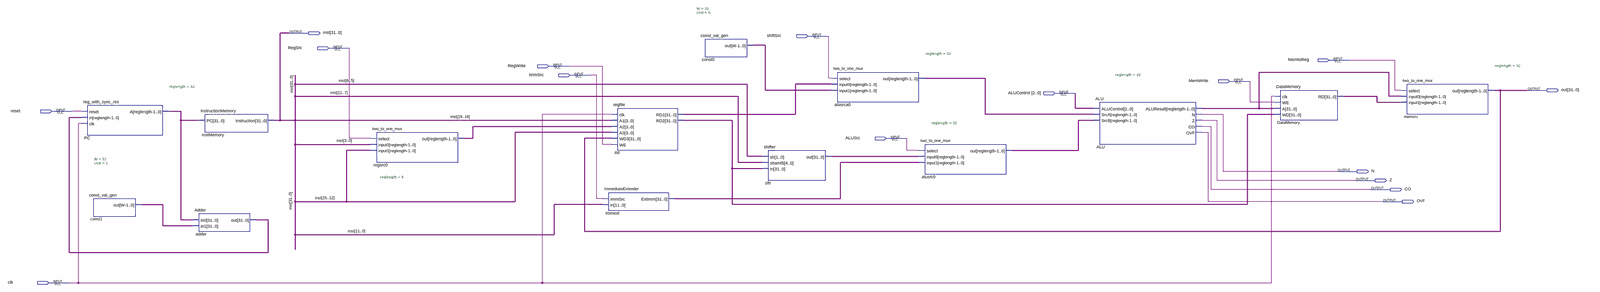
[diagram p0: schematic sheet, whole]
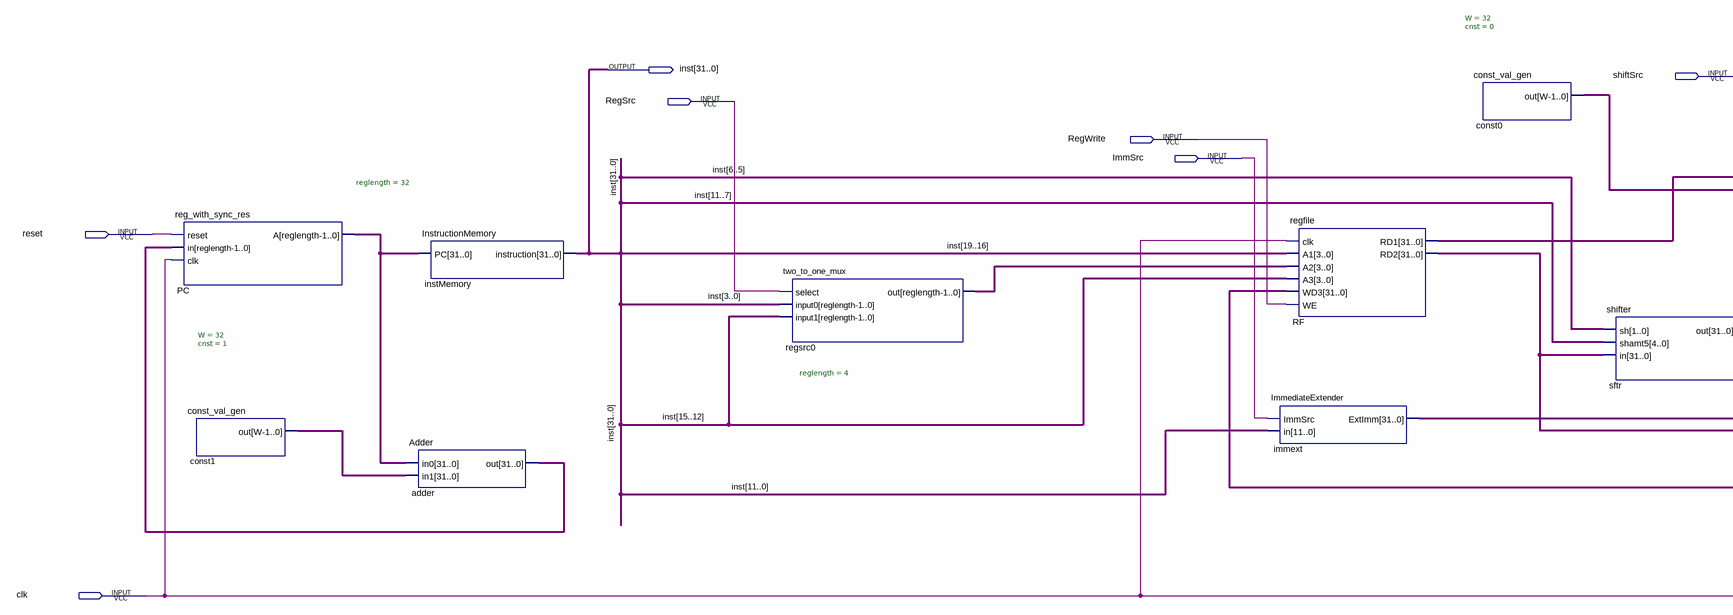
[diagram p1: schematic sheet, left part]
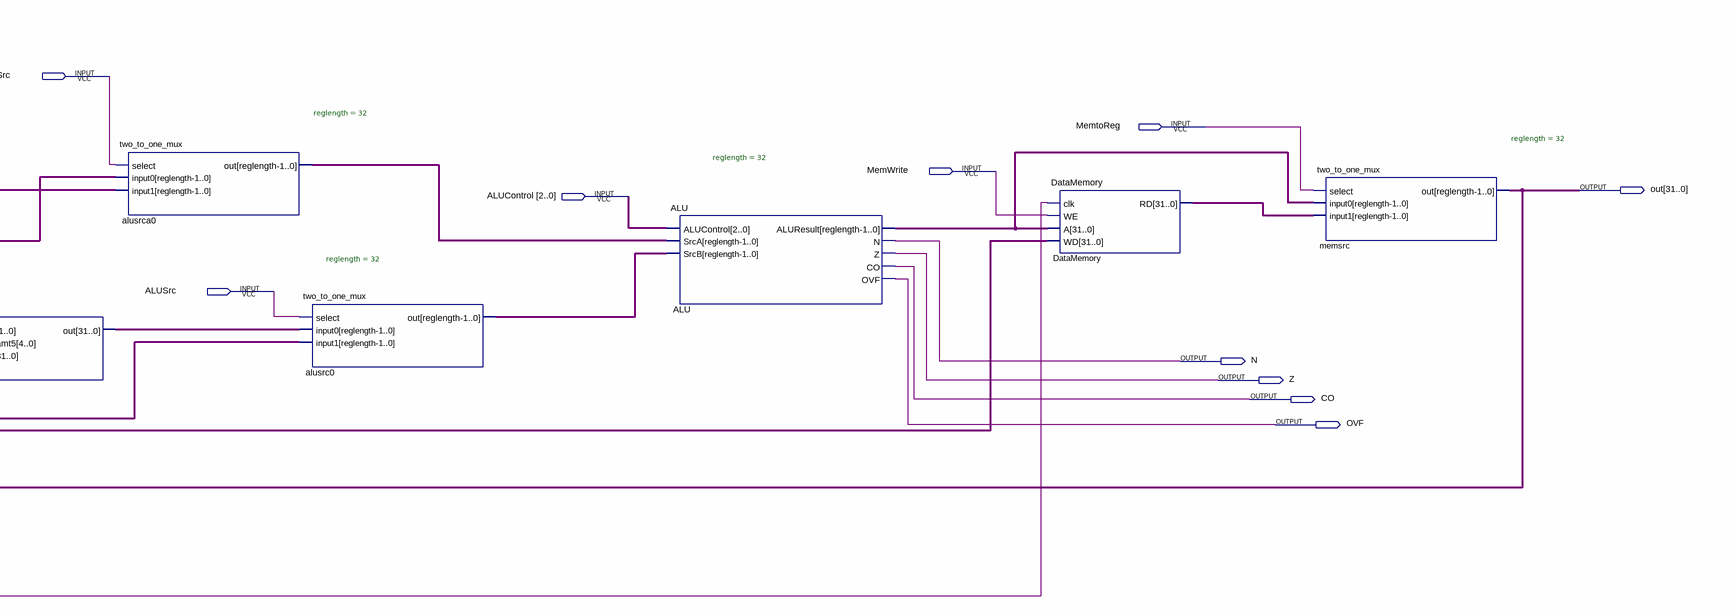
[diagram p2: schematic sheet, right part]
// Quartus schematic Datapath.bdf as structural Verilog: 14 symbols, 16 pins
module Datapath (
  input  shiftSrc,
  input  RegSrc,
  input  MemtoReg,
  input  RegWrite,
  input  ImmSrc,
  input  MemWrite,
  input  [2:0] ALUControl,
  input  reset,
  input  ALUSrc,
  input  clk,
  output [31:0] inst,
  output [31:0] out,
  output N,
  output Z,
  output CO,
  output OVF
);

  wire [3:0] regsrc0_out;
  wire [31:0] adder_out, ALU_aluresult, alusrc0_out, alusrca0_out, const0_out, const1_out, DataMemory_rd,
       immext_extimm, PC_a, RF_rd1, RF_rd2, sftr_out;

  reg_with_sync_res #(.reglength(32)) PC (.reset(reset), .in(adder_out), .clk(clk), .A(PC_a));
  const_val_gen #(.W(32), .cnst(1)) const1 (.out(const1_out));
  InstructionMemory instMemory (.PC(PC_a), .instruction(inst));
  Adder adder (.in0(PC_a), .in1(const1_out), .out(adder_out));
  two_to_one_mux #(.reglength(4)) regsrc0 (
    .select(RegSrc), .input0(inst[3:0]), .input1(inst[15:12]), .out(regsrc0_out));
  regfile RF (
    .clk(clk), .A1(inst[19:16]), .A2(regsrc0_out), .A3(inst[15:12]), .WD3(out), .WE(RegWrite), .RD1(RF_rd1),
    .RD2(RF_rd2));
  ImmediateExtender immext (.ImmSrc(ImmSrc), .in(inst[11:0]), .ExtImm(immext_extimm));
  const_val_gen #(.W(32), .cnst(0)) const0 (.out(const0_out));
  shifter sftr (.sh(inst[6:5]), .shamt5(inst[11:7]), .in(RF_rd2), .out(sftr_out));
  two_to_one_mux #(.reglength(32)) alusrca0 (
    .select(shiftSrc), .input0(RF_rd1), .input1(const0_out), .out(alusrca0_out));
  two_to_one_mux #(.reglength(32)) alusrc0 (
    .select(ALUSrc), .input0(sftr_out), .input1(immext_extimm), .out(alusrc0_out));
  ALU #(.reglength(32)) ALU (
    .ALUControl(ALUControl), .SrcA(alusrca0_out), .SrcB(alusrc0_out), .ALUResult(ALU_aluresult), .N(N),
    .Z(Z), .CO(CO), .OVF(OVF));
  DataMemory DataMemory (.clk(clk), .WE(MemWrite), .A(ALU_aluresult), .WD(RF_rd2), .RD(DataMemory_rd));
  two_to_one_mux #(.reglength(32)) memsrc (
    .select(MemtoReg), .input0(ALU_aluresult), .input1(DataMemory_rd), .out(out));
endmodule
